# EAGLE design ME433_HW4 (EAGLE 9.6.2)
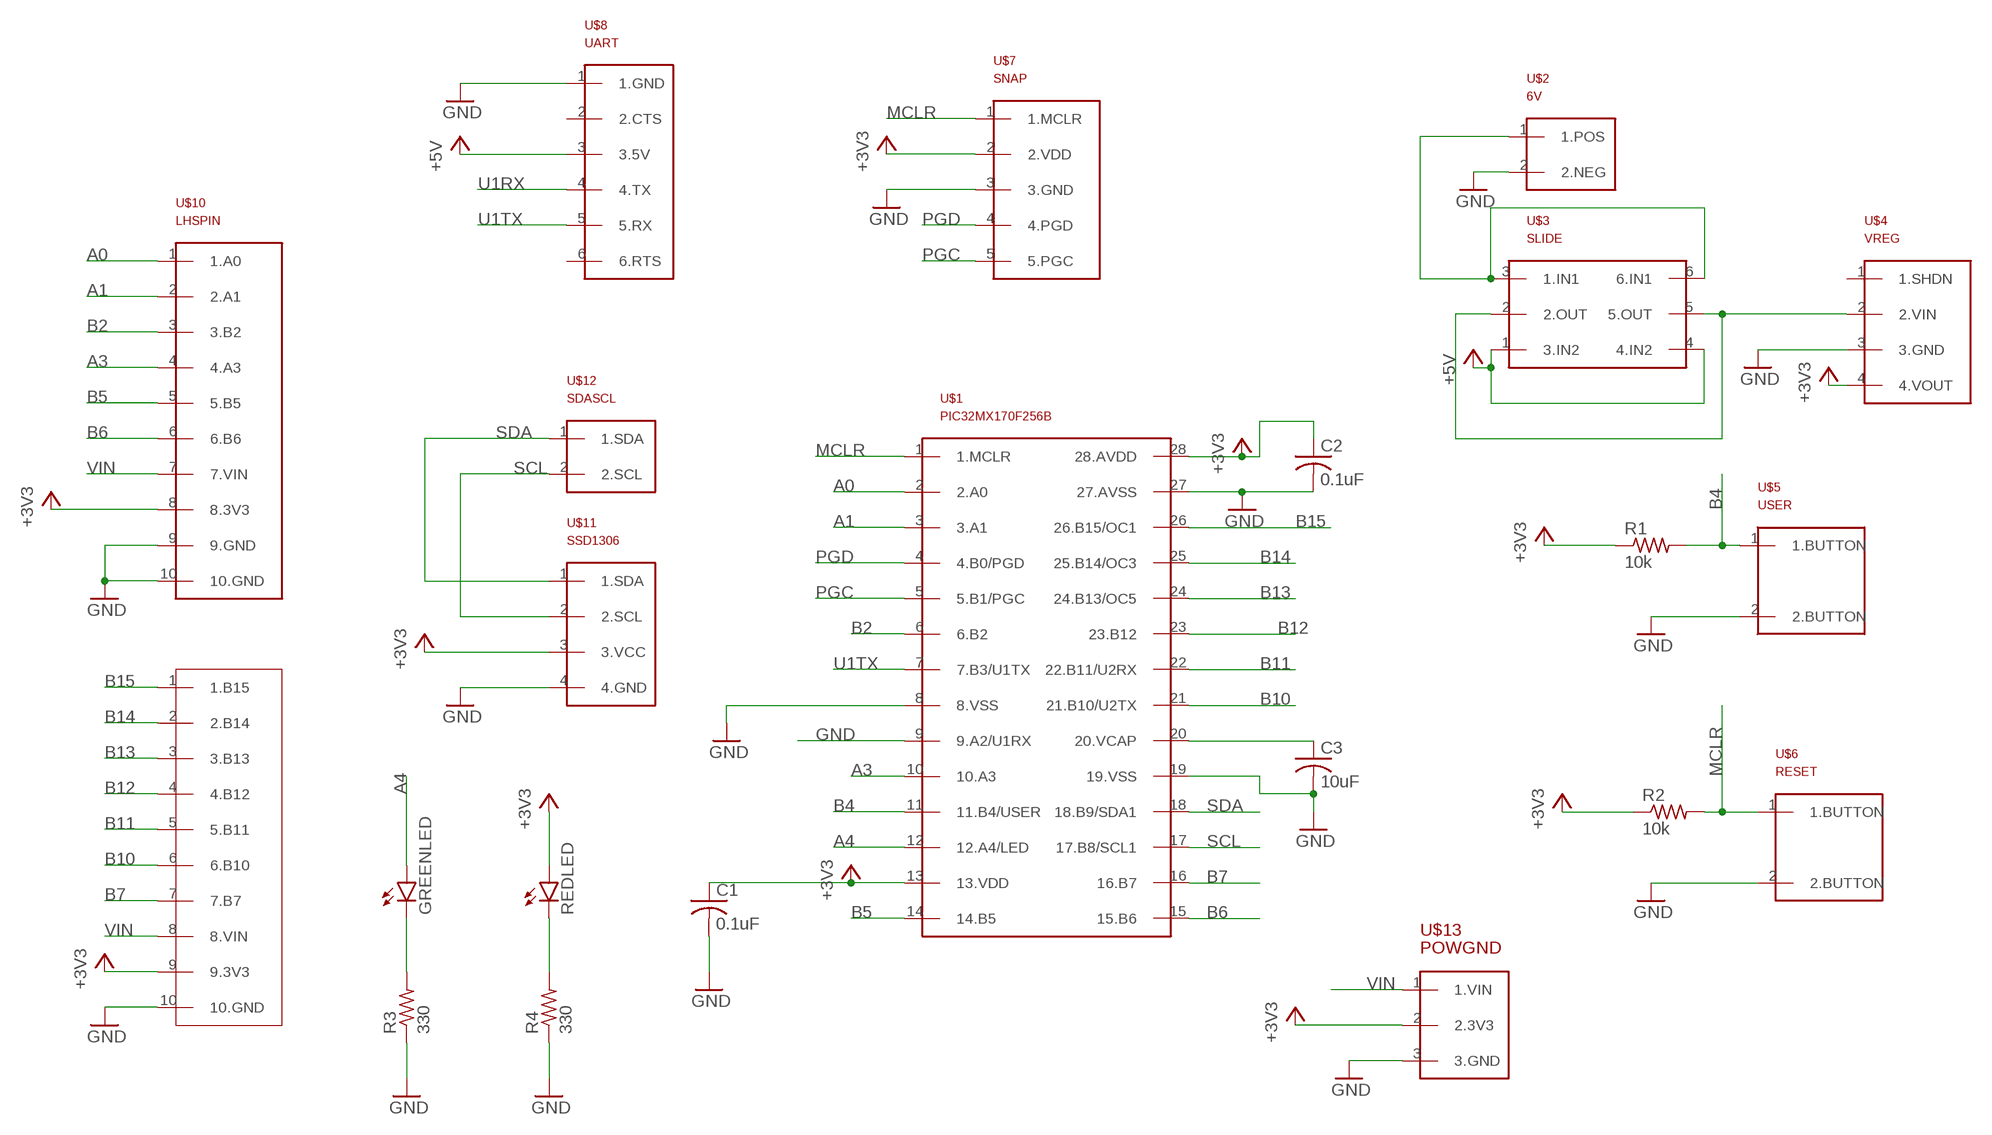
[diagram p0: schematic, sheet 1]

## Parts
C1  0.1uF  C-US025-030X050  [C025-030X050]
C2  0.1uF  C-US025-030X050  [C025-030X050]
C3  10uF  C-US025-030X050  [C025-030X050]
GREENLED  LED3MM  [LED3MM]
R1  10k  R-US_0207/10  [0207/10]
R2  10k  R-US_0207/10  [0207/10]
R3  330  R-US_0207/10  [0207/10]
R4  330  R-US_0207/10  [0207/10]
REDLED  LED3MM  [LED3MM]
U$1  PIC32MX170F256B  [DIL28-3]
U$2  6V  [6V]
U$3  SLIDE  [2X3]
U$4  VREG  [VREG]
U$5  USER  [BUTTON]
U$6  RESET  [BUTTON]
U$7  SNAP  [1X05]
U$8  UART  [UART]
U$9  RHS_PIN  [RHSPIN]
U$10  LHSPIN  [LHSPIN]
U$11  SSD1306  [SSD1306]
U$12  SDASCL  [SDASCL]
U$13  POWGND  [POWGND]

## Nets
+3V3: C1.1 C2.1 R1.1 R2.1 REDLED.A U$1.13(13.VDD) U$1.28(28.AVDD) U$4.4(4.VOUT) U$7.2(2.VDD) U$9.9(9.3V3) U$10.8(8.3V3) U$11.3(3.VCC) U$13.2(2.3V3)
+5V: U$3.1(3.IN2) U$3.4(4.IN2) U$8.3(3.5V)
A0: U$1.2(2.A0) U$10.1(1.A0)
A1: U$1.3(3.A1) U$10.2(2.A1)
A3: U$1.10(10.A3) U$10.4(4.A3)
A4: GREENLED.A U$1.12(12.A4/LED)
B2: U$1.6(6.B2) U$10.3(3.B2)
B4: R1.2 U$1.11(11.B4/USER) U$5.1(1.BUTTON)
B5: U$1.14(14.B5) U$10.5(5.B5)
B6: U$1.15(15.B6) U$10.6(6.B6)
B7: U$1.16(16.B7) U$9.7(7.B7)
B10: U$1.21(21.B10/U2TX) U$9.6(6.B10)
B11: U$1.22(22.B11/U2RX) U$9.5(5.B11)
B12: U$1.23(23.B12) U$9.4(4.B12)
B13: U$1.24(24.B13/OC5) U$9.3(3.B13)
B14: U$1.25(25.B14/OC3) U$9.2(2.B14)
B15: U$1.26(26.B15/OC1) U$9.1(1.B15)
GND: C1.2 C2.2 C3.2 R3.1 R4.1 U$1.8(8.VSS) U$1.19(19.VSS) U$1.27(27.AVSS) U$2.2(2.NEG) U$4.3(3.GND) U$5.2(2.BUTTON) U$6.2(2.BUTTON) U$7.3(3.GND) U$8.1(1.GND) U$9.10(10.GND) U$10.9(9.GND) U$10.10(10.GND) U$11.4(4.GND) U$13.3(3.GND)
MCLR: R2.2 U$1.1(1.MCLR) U$6.1(1.BUTTON) U$7.1(1.MCLR)
N$1: U$2.1(1.POS) U$3.3(1.IN1) U$3.6(6.IN1)
N$2: R4.2 REDLED.K(C)
N$5: GREENLED.K(C) R3.2
N$9: C3.1 U$1.20(20.VCAP)
PGC: U$1.5(5.B1/PGC) U$7.5(5.PGC)
PGD: U$1.4(4.B0/PGD) U$7.4(4.PGD)
SCL: U$1.17(17.B8/SCL1) U$11.2(2.SCL) U$12.2(2.SCL)
SDA: U$1.18(18.B9/SDA1) U$11.1(1.SDA) U$12.1(1.SDA)
U1RX: U$1.9(9.A2/U1RX) U$8.4(4.TX)
U1TX: U$1.7(7.B3/U1TX) U$8.5(5.RX)
VIN: U$3.2(2.OUT) U$3.5(5.OUT) U$4.2(2.VIN) U$9.8(8.VIN) U$10.7(7.VIN) U$13.1(1.VIN)
Unconnected: U$4.1(1.SHDN) U$8.2(2.CTS) U$8.6(6.RTS)

## Library data of the parts
C1-C3 = ME433LIB:C-US: CAPACITOR, American symbol; SPICEPREFIX: C
GREENLED REDLED = ME433LIB:LED: LED OSRAM: - CHIPLED LG R971, LG N971, LY N971, LG Q971, LY Q971, LO R971, LY R971 LH N974, LH R974 LS Q976, LO Q976, LY Q976 LO Q996 - Hyper CHIPLED LW Q18S LB Q993, LB Q99A, LB R99A - SideLED LS A670, LO A670, LY A670, LG A670, LP A670 LB A673, LV A673, LT A673, LW A673 LH A674 LY A675 LS A676, LA A676, LO A676, LY A676, LW A676 LS A679, LY A679, LG A679 - Hyper Micro SIDELED® LS Y876, LA Y876, LO Y876, LY Y876 LT Y87S - SmartLED LW L88C, LW L88S LB L89C, LB L89S, LG L890 LS L89K, LO L89K, LY L89K LS L896, LA L896, LO L896, LY L896 - TOPLED LS T670, LO T670, LY T670, LG T670, LP T670 LSG T670, LSP T670, LSY T670, LOP T670, LYG T670 LG T671, LOG T671, LSG T671 LB T673, LV T673, LT T673, LW T673 LH T674 LS T676, LA T676, LO T676, LY T676, LB T676, LH T676, LSB T676, LW T676 LB T67C, LV T67C, LT T67C, LS T67K, LO T67K, LY T67K, LW E67C LS E67B, LA E67B, LO E67B, LY E67B, LB E67C, LV E67C, LT E67C LW T67C LS T679, LY T679, LG T679 LS T770, LO T770, LY T770, LG T770, LP T770 LB T773, LV T773, LT T773, LW T773 LH T774 LS E675, LA E675, LY E675, LS T675 LS T776, LA T776, LO T776, LY T776, LB T776 LHGB T686 LT T68C, LB T68C - Hyper Mini TOPLED® LB M676 - Mini TOPLED Santana® LG M470 LS M47K, LO M47K, LY M47K Source: http://www.osram.convergy.de LUXEON: - LUMILED® LXK2-PW12-R00, LXK2-PW12-S00, LXK2-PW14-U00, LXK2-PW14-V00 LXK2-PM12-R00, LXK2-PM12-S00, LXK2-PM14-U00 LXK2-PE12-Q00, LXK2-PE12-R00, LXK2-PE12-S00, LXK2-PE14-T00, LXK2-PE14-U00 LXK2-PB12-K00, LXK2-PB12-L00, LXK2-PB12-M00, LXK2-PB14-N00, LXK2-PB14-P00, LXK2-PB14-Q00 LXK2-PR12-L00, LXK2-PR12-M00, LXK2-PR14-Q00, LXK2-PR14-R00 LXK2-PD12-Q00, LXK2-PD12-R00, LXK2-PD12-S00 LXK2-PH12-R00, LXK2-PH12-S00 LXK2-PL12-P00, LXK2-PL12-Q00, LXK2-PL12-R00 Source: www.luxeon.com KINGBRIGHT: KA-3528ASYC Source: www.kingbright.com
R1-R4 = ME433LIB:R-US_: RESISTOR, American symbol; SPICEPREFIX: R
U$1 = ME_433_PCB:PIC32MX170F256B
U$2 = ME433LIB:6V
U$3 = ME433LIB:SLIDE
U$4 = ME433LIB:VREG
U$5 = ME433LIB:USER
U$6 = ME433LIB:RESET
U$7 = ME433LIB:SNAP
U$8 = ME433LIB:UART
U$9 = ME433LIB:RHS_PIN
U$10 = ME433LIB:LHSPIN
U$11 = ME433LIB:SSD1306
U$12 = ME433LIB:SDASCL
U$13 = ME433LIB:POWGND

## Board
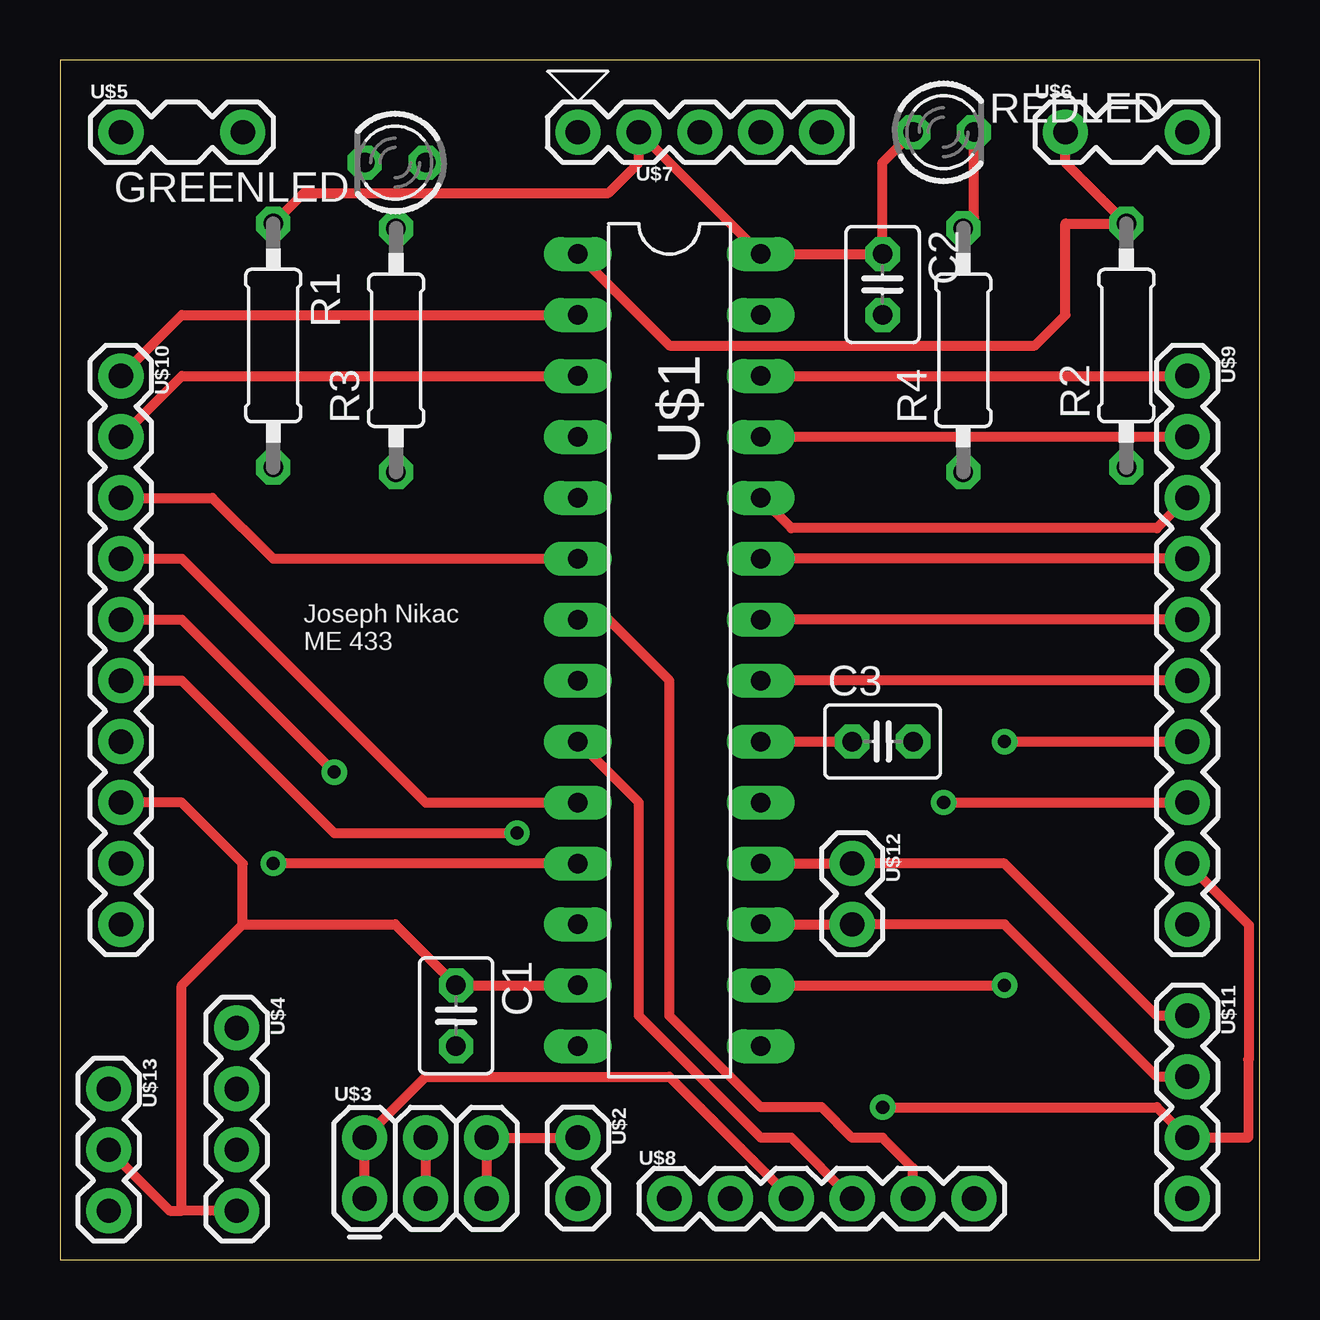
[diagram p1: board, top side]
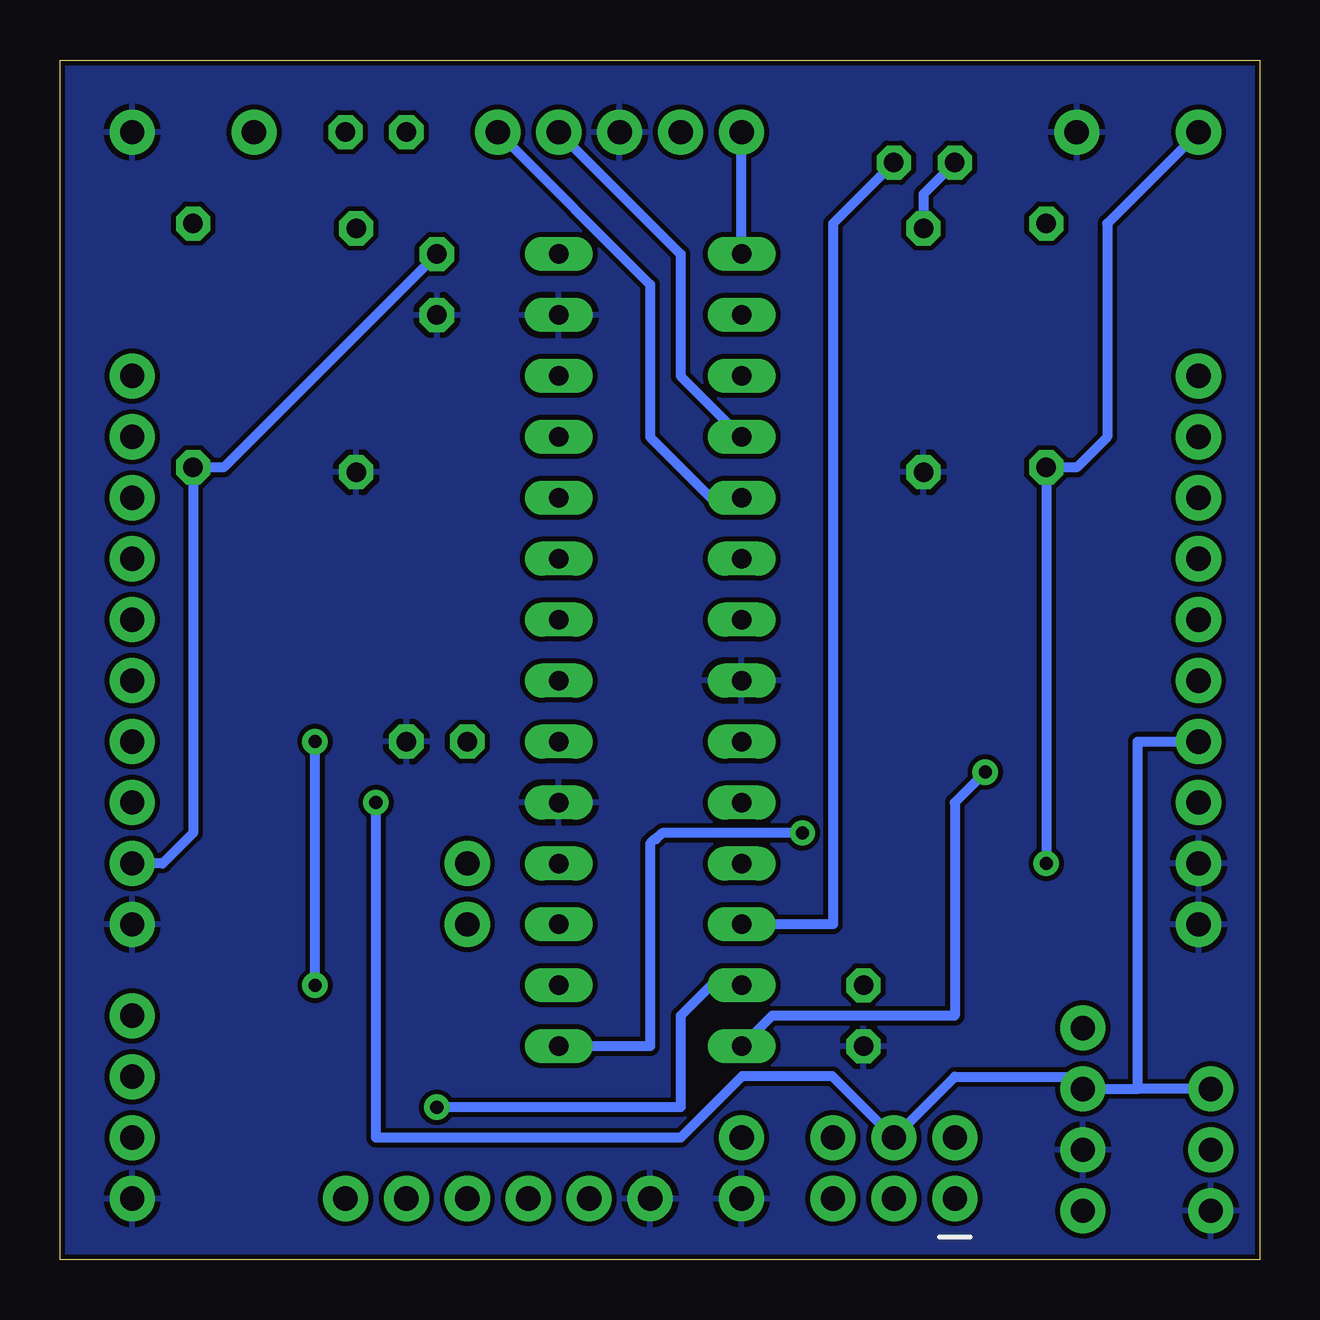
[diagram p2: board, bottom side, seen from below]

Size 50 x 50 mm. Coordinates in mm from the lower left corner, seen from the top.
Outline: 0,0 50,0 50,50 0,50 0,0
Copper layers (1*16): Top 0.035mm / dielectric 1.5mm / Bottom 0.035mm
Design rules "SparkFun": minimum track width 8mil, minimum drill 20mil, track to track 8mil, track to pad 8mil, pad to pad 8mil, via to via 8mil, smd to smd 8mil, copper to edge 8mil, drill to drill 8mil, minimum pad ring 12mil, minimum via ring 10mil, stop-mask expansion 4mil, vias tented up to drill 20mil, thermal gap 10mil

### Footprints (pad centres in the part's own frame; a part is rotated, then mirrored left to right if it is on the bottom)
C025-030X050 = drill 0.813 octagon: 1 -1.27,0; 2 1.27,0
LED3MM = drill 0.813 octagon: A -1.27,0; K 1.27,0
0207/10 = drill 0.813 octagon: 1 -5.08,0; 2 5.08,0
DIL28-3 = drill 0.813 long: 1 -16.51,-3.81; 2 -13.97,-3.81; 3 -11.43,-3.81; 4 -8.89,-3.81; 5 -6.35,-3.81; 6 -3.81,-3.81; 7 -1.27,-3.81; 8 1.27,-3.81; 9 3.81,-3.81; 10 6.35,-3.81; 11 8.89,-3.81; 12 11.43,-3.81; 13 13.97,-3.81; 14 16.51,-3.81; 15 16.51,3.81; 16 13.97,3.81; 17 11.43,3.81; 18 8.89,3.81; 19 6.35,3.81; 20 3.81,3.81; 21 1.27,3.81; 22 -1.27,3.81; 23 -3.81,3.81; 24 -6.35,3.81; 25 -8.89,3.81; 26 -11.43,3.81; 27 -13.97,3.81; 28 -16.51,3.81
6V = drill 1.016 pad 1.88: 1 -1.27,0; 2 1.27,0
2X3 = drill 1.016 pad 1.88: 1 0,0; 2 2.54,0; 3 5.08,0; 4 0,2.54; 5 2.54,2.54; 6 5.08,2.54
VREG = drill 1.016 pad 1.88: 1 -3.81,0; 2 -1.27,0; 3 1.27,0; 4 3.81,0
BUTTON = drill 1.016 pad 1.88: 1 -2.54,0; 2 2.54,0
1X05 = drill 1.016 pad 1.88: 1 0,0; 2 2.54,0; 3 5.08,0; 4 7.62,0; 5 10.16,0
UART = drill 1.016 pad 1.88: 1 -6.35,0; 2 -3.81,0; 3 -1.27,0; 4 1.27,0; 5 3.81,0; 6 6.35,0
RHSPIN = drill 1.016 pad 1.88: 1 -11.43,0; 2 -8.89,0; 3 -6.35,0; 4 -3.81,0; 5 -1.27,0; 6 1.27,0; 7 3.81,0; 8 6.35,0; 9 8.89,0; 10 11.43,0
LHSPIN = drill 1.016 pad 1.88: 1 -11.43,0; 2 -8.89,0; 3 -6.35,0; 4 -3.81,0; 5 -1.27,0; 6 1.27,0; 7 3.81,0; 8 6.35,0; 9 8.89,0; 10 11.43,0
SSD1306 = drill 1.016 pad 1.88: 1 -3.81,0; 2 -1.27,0; 3 1.27,0; 4 3.81,0
SDASCL = drill 1.016 pad 1.88: 1 -1.27,0; 2 1.27,0
POWGND = drill 1.016 pad 1.88: 1 -2.54,0; 2 0,0; 3 2.54,0

### Placement (x,y rotation side)
C1  16.51,10.16 270 top
C2  34.29,40.64 270 top
C3  34.29,21.59 0 top
GREENLED  13.97,45.72 180 top
R1  8.89,38.1 270 top
R2  44.45,38.1 90 top
R3  14.01,37.9 90 top
R4  37.65,37.9 90 top
REDLED  36.83,46.99 0 top
U$1  25.4,25.4 270 top
U$2  21.59,3.81 270 top
U$3  12.7,2.54 0 top
U$4  7.37,5.84 270 top
U$5  5.08,46.99 0 top
U$6  44.45,46.99 0 top
U$7  21.59,46.99 0 top
U$8  31.75,2.54 0 top
U$9  46.99,25.4 270 top
U$10  2.54,25.4 270 top
U$11  46.99,6.35 270 top
U$12  33.02,15.24 270 top
U$13  2.03,4.57 270 top

### Tracks (layer width: path | path; a pad name or v marks a point on that pad's centre or on a via)
+3V3  (via drill 0.55 pad 0.55)
  Top 0.406: U$4.4 5.08,2.03 | 5.08,2.03 4.57,2.03 U$13.2 | U$10.8 5.08,19.05 7.62,16.51 7.62,13.97 | 5.08,2.03 5.08,11.43 7.62,13.97 | 7.62,13.97 13.97,13.97 C1.1 U$1.13 | U$9.9 49.55,13.95 49.55,8.35 49.53,8.33 49.53,5.08 U$11.3 45.72,6.35 v34.29,6.35 | REDLED.A 34.29,45.72 C2.1 U$1.28 U$7.2 24.13,45.72 22.86,44.45 10.16,44.45 R1.1
  Bottom 0.406: U$1.13 22.86,11.43 24.13,10.16 24.13,6.35 v34.29,6.35 | C2.1 43.18,33.02 R2.1 44.45,17.78 45.72,16.51 U$9.9
+5V
  Top 0.406: U$3.1 U$3.4 15.24,7.62 25.4,7.62 U$8.3
A0
  Top 0.406: U$10.1 5.08,39.37 U$1.2
A1
  Top 0.406: U$10.2 5.08,36.83 U$1.3
A3
  Top 0.406: U$10.4 5.08,29.21 15.24,19.05 U$1.10
A4
  Bottom 0.406: GREENLED.A 17.78,43.18 17.78,13.97 U$1.12
B2
  Top 0.406: U$10.3 6.35,31.75 8.89,29.21 U$1.6
B4  (via drill 0.55)
  Top 0.406: U$1.11 v8.89,16.51
  Bottom 0.406: U$5.1 6.35,43.18 6.35,34.29 7.62,33.02 R1.2 v8.89,16.51
B5  (via drill 0.55)
  Top 0.406: U$10.5 5.08,26.67 v11.43,20.32
  Bottom 0.406: v11.43,20.32 12.7,19.05 12.7,10.16 20.32,10.16 U$1.14
B6  (via drill 0.55)
  Top 0.406: U$10.6 5.08,24.13 11.43,17.78 v19.05,17.78
  Bottom 0.406: v19.05,17.78 24.89,17.78 25.15,17.53 25.21,17.53 25.4,17.34 25.4,8.89 U$1.15
B7  (via drill 0.55, 0.55 pad 0.55)
  Top 0.406: U$1.16 v39.37,11.43 | v39.37,21.59 U$9.7
  Bottom 0.406: v39.37,11.43 v39.37,21.59
B10
  Top 0.406: U$9.6 U$1.21
B11
  Top 0.406: U$9.5 U$1.22
B12
  Top 0.406: U$9.4 U$1.23
B13
  Top 0.406: U$9.3 45.72,30.48 30.48,30.48 U$1.24
B14
  Top 0.406: U$9.2 U$1.25
B15
  Top 0.406: U$1.26 U$9.1
GND
  pour Bottom (isolate 0.127): 0,0 50,0 50,50 0,50
MCLR
  Top 0.406: U$1.1 25.4,38.1 40.64,38.1 41.91,39.37 41.91,43.18 R2.2 41.91,45.72 U$6.1
  Bottom 0.406: U$1.1 U$7.1
N$1
  Top 0.406: U$3.3 U$3.6 U$2.1
N$2
  Top 0.406: R4.2 38.1,43.43 REDLED.K
N$5
  Bottom 0.406: GREENLED.K 14.01,44.41 R3.2
N$9
  Top 0.406: U$1.20 C3.1
PGC
  Bottom 0.406: U$7.5 25.4,40.64 25.4,34.29 22.86,31.75 U$1.5
PGD
  Bottom 0.406: U$7.4 24.13,41.91 24.13,36.83 U$1.4
SCL
  Top 0.406: U$11.2 45.72,7.62 39.37,13.97 U$12.2 U$1.17
SDA
  Top 0.406: U$11.1 45.72,10.16 39.37,16.51 U$12.1 U$1.18
U1RX
  Top 0.406: U$8.4 30.48,5.08 29.21,5.08 24.13,10.16 24.13,19.05 U$1.9
U1TX
  Top 0.406: U$8.5 35.56,3.81 34.29,5.08 33.02,5.08 31.75,6.35 29.21,6.35 25.4,10.16 25.4,24.13 22.86,26.67 U$1.7
VIN  (via drill 0.55)
  Top 0.406: U$3.5 U$3.2 | v36.83,19.05 U$9.8
  Bottom 0.406: U$13.1 5.08,7.11 | 5.08,7.11 U$4.2 7.87,7.62 12.7,7.62 U$3.5 17.8,7.64 21.57,7.64 24.13,5.08 36.83,5.08 v36.83,19.05 | 5.08,7.11 5.08,21.59 U$10.7

### Text on the board
tPlace: Joseph Nikac / ME 433